# EAGLE design RadioESP32S3 (EAGLE 7.7.0)
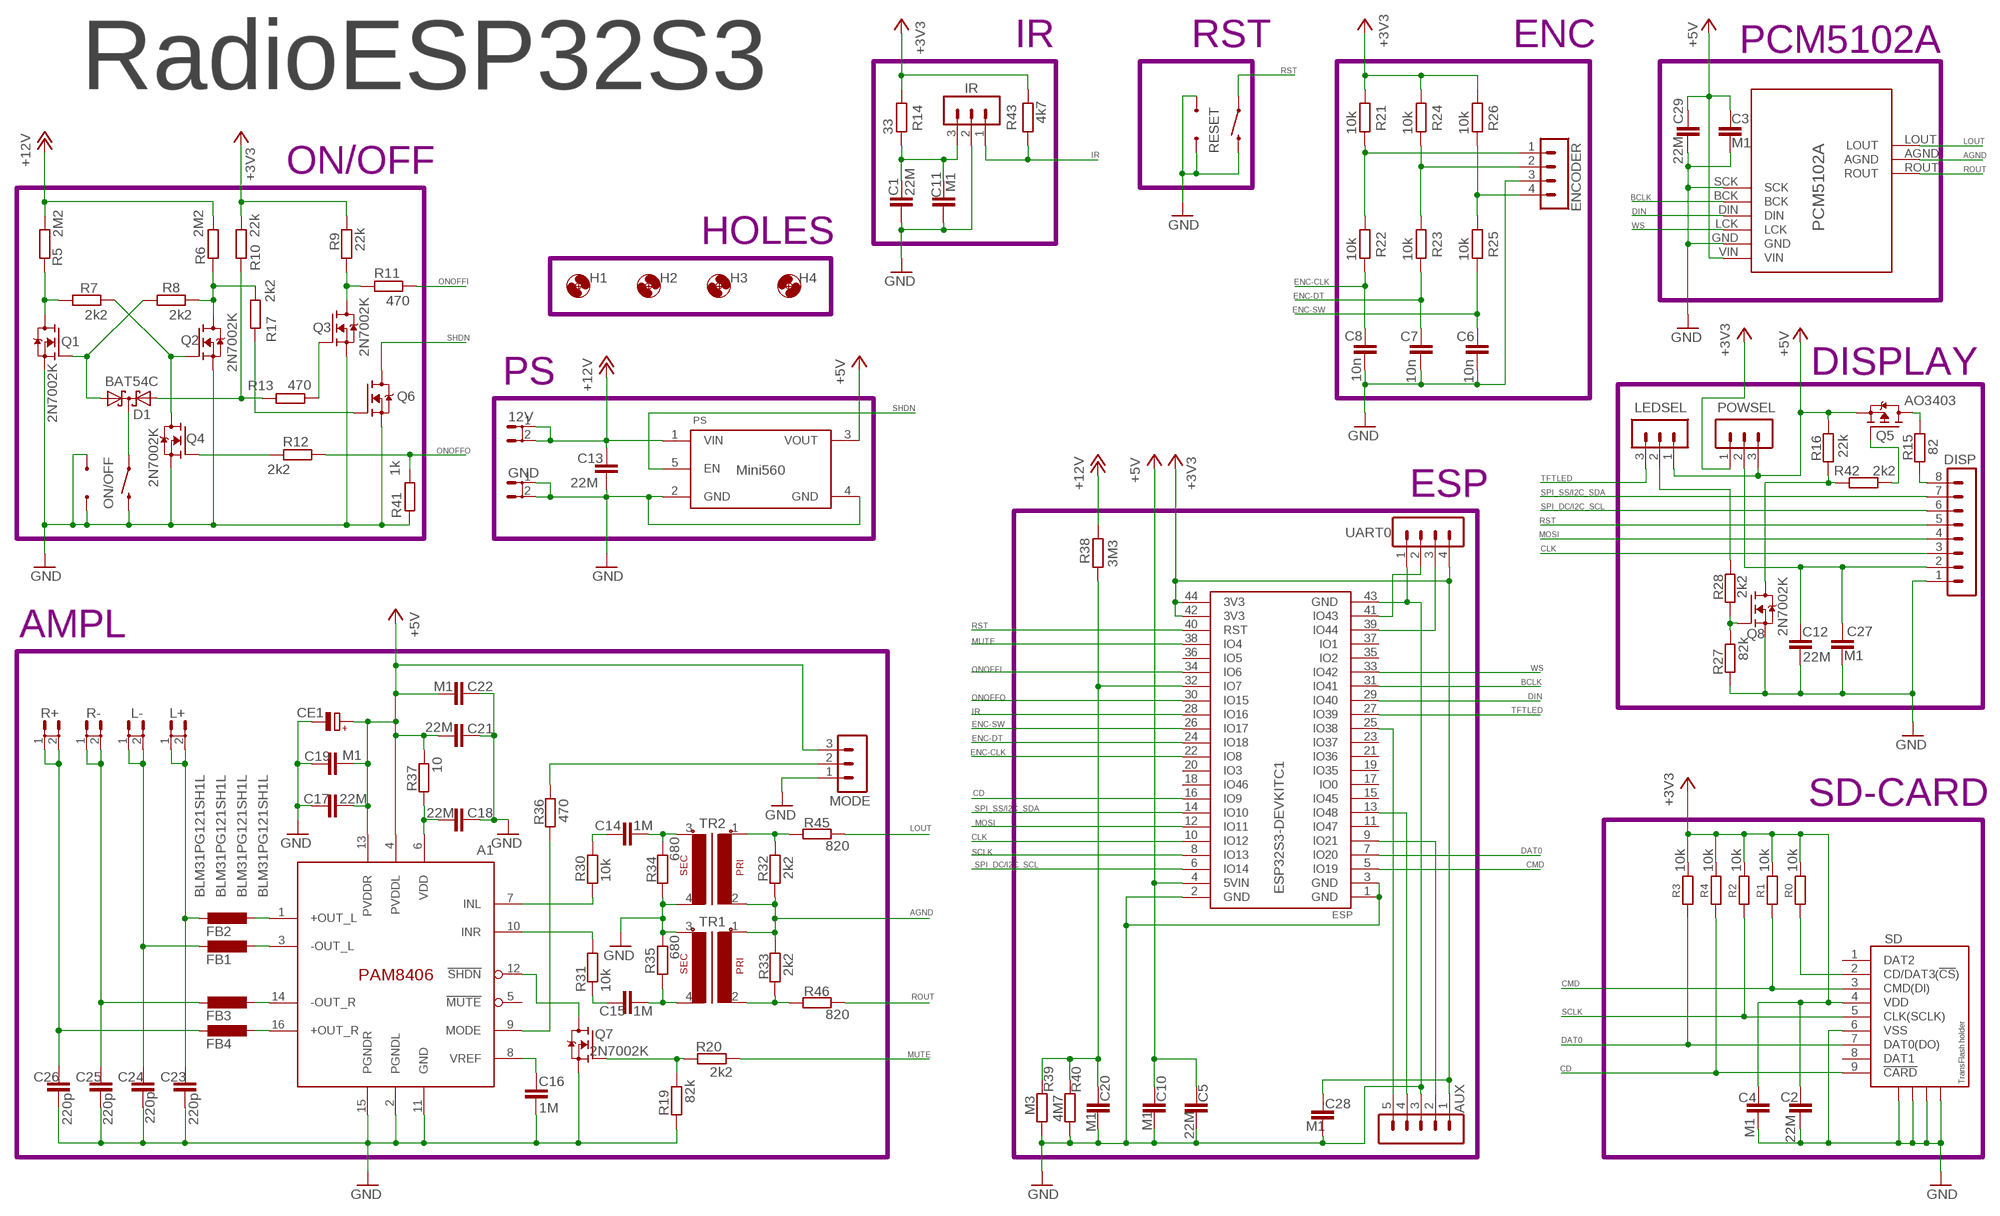
[diagram p0: schematic, sheet 1]

## Parts
12V  FASTON  [FASTON4.8]
A1  PAM8406  [SOP-16]
AUX  CON-LSTB_MA05-108  [CON-LSTB_MA05-1-NS08]
C1  22M  C-EUC1206K  [C1206K]
C2  22M  C-EUC1206K  [C1206K]
C3  M1  C-EUC0805  [C0805]
C4  M1  C-EUC0805  [C0805]
C5  22M  C-EUC1206K  [C1206K]
C6  10n  C-EUC0805  [C0805]
C7  10n  C-EUC0805  [C0805]
C8  10n  C-EUC0805  [C0805]
C10  M1  C-EUC0805  [C0805]
C11  M1  C-EUC0805  [C0805]
C12  22M  C-EUC1206K  [C1206K]
C13  22M  C-EUC1206K  [C1206K]
C14  1M  C-EUC1206K  [C1206K]
C15  1M  C-EUC1206K  [C1206K]
C16  1M  C-EUC1206K  [C1206K]
C17  22M  C-EUC1206K  [C1206K]
C18  22M  C-EUC1206K  [C1206K]
C19  M1  C-EUC0805  [C0805]
C20  M1  C-EUC0805  [C0805]
C21  22M  C-EUC1206K  [C1206K]
C22  M1  C-EUC0805  [C0805]
C23  220p  C-EUC0805  [C0805]
C24  220p  C-EUC0805  [C0805]
C25  220p  C-EUC0805  [C0805]
C26  220p  C-EUC0805  [C0805]
C27  M1  C-EUC0805  [C0805]
C28  M1  C-EUC0805  [C0805]
C29  22M  C-EUC1206K  [C1206K]
CE1  CPOL  [E5-10.5]
D1  BAT54C  [SOT23]
DISP  CON-LSTB_MA08-108  [CON-LSTB-MA08-1-NS08]
ENCODER  CON-LSTB_MA04-108  [CON-LSTB_MA04-1-NS08]
ESP  ESP32S3-DEVKITC1  [ESP32S3-DEVKITC1]
FB1  BLM31PG121SH1L  BEAD_0805-K  [C1206K]
FB2  BLM31PG121SH1L  BEAD_0805-K  [C1206K]
FB3  BLM31PG121SH1L  BEAD_0805-K  [C1206K]
FB4  BLM31PG121SH1L  BEAD_0805-K  [C1206K]
GND  FASTON  [FASTON4.8]
H1  MOUNT-HOLE3.0  [3,0]
H2  MOUNT-HOLE3.0  [3,0]
H3  MOUNT-HOLE3.0  [3,0]
H4  MOUNT-HOLE3.0  [3,0]
IR  CON-LSTB_MA03-108  [CON-LSTB_MA03-1-NS08]
L+  FASTON  [FASTON4.8]
L-  FASTON  [FASTON4.8]
LEDSEL  CON-LSTB_MA03-108  [CON-LSTB_MA03-1-NS08]
MODE  CON-LSTB_MA03-108  [CON-LSTB_MA03-1-NS08]
ON/OFF  MOMENTARY-SWITCH-SPST1  [TACTILE_SWITCH_ANGLE-NS1]
PCM5102A  PCM5102A_MODULE  [PCM5102A_MODULE]
POWSEL  CON-LSTB_MA03-108  [CON-LSTB_MA03-1-NS08]
PS  MINI560EXT  [MINI560-NS-EXT]
Q1  2N7002K  TRANSISTOR-FET_N-MOSFET  [TRANSISTOR-FET_SOT23]
Q2  2N7002K  TRANSISTOR-FET_N-MOSFET  [TRANSISTOR-FET_SOT23]
Q3  2N7002K  TRANSISTOR-FET_N-MOSFET  [TRANSISTOR-FET_SOT23]
Q4  2N7002K  TRANSISTOR-FET_N-MOSFET  [TRANSISTOR-FET_SOT23]
Q5  AO3403  P-MOSFET  [SOT23]
Q6  2N7002K  TRANSISTOR-FET_N-MOSFET  [TRANSISTOR-FET_SOT23]
Q7  2N7002K  TRANSISTOR-FET_N-MOSFET  [TRANSISTOR-FET_SOT23]
Q8  2N7002K  TRANSISTOR-FET_N-MOSFET  [TRANSISTOR-FET_SOT23]
R0  10k  R-EU_R0805  [R0805]
R1  10k  R-EU_R0805  [R0805]
R2  10k  R-EU_R0805  [R0805]
R3  10k  R-EU_R0805  [R0805]
R4  10k  R-EU_R0805  [R0805]
R5  2M2  R-EU_R0805  [R0805]
R6  2M2  R-EU_R0805  [R0805]
R7  2k2  R-EU_R0805  [R0805]
R8  2k2  R-EU_R0805  [R0805]
R9  22k  R-EU_R0805  [R0805]
R10  22k  R-EU_R0805  [R0805]
R11  470  R-EU_R0805  [R0805]
R12  2k2  R-EU_R0805  [R0805]
R13  470  R-EU_R0805  [R0805]
R14  33  R-EU_R0805  [R0805]
R15  82  R-EU_R1206  [R1206]
R16  22k  R-EU_R0805  [R0805]
R17  2k2  R-EU_R0805  [R0805]
R19  82k  R-EU_R0805  [R0805]
R20  2k2  R-EU_R0805  [R0805]
R21  10k  R-EU_R0805  [R0805]
R22  10k  R-EU_R0805  [R0805]
R23  10k  R-EU_R0805  [R0805]
R24  10k  R-EU_R0805  [R0805]
R25  10k  R-EU_R0805  [R0805]
R26  10k  R-EU_R0805  [R0805]
R27  82k  R-EU_R0805  [R0805]
R28  2k2  R-EU_R0805  [R0805]
R30  10k  R-EU_R0805  [R0805]
R31  10k  R-EU_R0805  [R0805]
R32  2k2  R-EU_R0805  [R0805]
R33  2k2  R-EU_R0805  [R0805]
R34  680  R-EU_R0805  [R0805]
R35  680  R-EU_R0805  [R0805]
R36  470  R-EU_R0805  [R0805]
R37  10  R-EU_R0805  [R0805]
R38  3M3  R-EU_R0805  [R0805]
R39  M3  R-EU_R0805  [R0805]
R40  4M7  R-EU_R0805  [R0805]
R41  1k  R-EU_R0805  [R0805]
R42  2k2  R-EU_R0805  [R0805]
R43  4k7  R-EU_R0805  [R0805]
R45  820  R-EU_R0805  [R0805]
R46  820  R-EU_R0805  [R0805]
R+  FASTON  [FASTON4.8]
R-  FASTON  [FASTON4.8]
RESET  MOMENTARY-SWITCH-SPST1  [TACTILE_SWITCH_ANGLE-NS1]
SD  SD-MMC_TF-HOLDER  [SD-MMC_TF-PULL]
TR1  AUDIOTRAFONS2  [AUDIOTRAFO_2-NS]
TR2  AUDIOTRAFONS2  [AUDIOTRAFO_2-NS]
UART0  CON-LSTB_MA04-108  [CON-LSTB_MA04-1-NS08]

## Nets
+3V3: AUX.1 C2.2 C4.2 C28.2 ESP.42(3V3) ESP.44(3V3) POWSEL.1 R0.2 R1.2 R2.2 R3.2 R4.2 R9.2 R10.2 R14.2 R21.2 R24.2 R26.2 R43.1 SD.4(VDD) UART0.4
+5V: A1.4(PVDDL) A1.13(PVDDR) C3.1 C5.1 C10.1 C17.2 C19.2 C21.1 C22.1 C29.2 CE1.+ CE1.++(+) ESP.4(5VIN) LEDSEL.1 MODE.3 PCM5102A.VIN POWSEL.3 PS.3(VOUT) Q5.2(S) R16.2 R37.1
+12V: 12V.1 12V.2 C13.2 PS.1(VIN) R5.2 R6.2 R38.2
AGND: PCM5102A.AGND R32.1 R33.2 TR1.1 TR2.2
BCLK: ESP.31(IO41) PCM5102A.BCK
CD: ESP.16(IO9) R4.1 SD.9(!CARD)
CLK: DISP.3 ESP.10(IO12)
CMD: ESP.5(IO19) R1.1 SD.3(CMD(DI))
DAT0: ESP.7(IO20) R3.1 SD.7(DAT0(DO))
DIN: ESP.29(IO40) PCM5102A.DIN
ENC-CLK: C8.1 ESP.22(IO8) R22.1
ENC-DT: C7.1 ESP.24(IO18) R23.1
ENC-SW: C6.1 ESP.26(IO17) R25.1
GND: A1.2(PGNDL) A1.11(GND) A1.15(PGNDR) AUX.3 C1.2 C2.1 C3.2 C4.1 C5.2 C6.2 C7.2 C8.2 C10.2 C11.2 C12.1 C13.1 C16.1 C17.1 C18.2 C19.1 C20.1 C21.2 C22.2 C23.1 C24.1 C25.1 C26.1 C27.2 C28.1 C29.1 CE1.- DISP.1 ENCODER.3 ESP.1(GND) ESP.2(GND) ESP.3(GND) ESP.43(GND) GND.1 GND.2 IR.2 MODE.1 ON/OFF.2 ON/OFF.A1 ON/OFF.A2 PCM5102A.GND PCM5102A.SCK PS.2(GND) PS.4(GND) Q1.2(S) Q2.2(S) Q3.2(S) Q4.2(S) Q6.2(S) Q7.2(S) Q8.2(S) R19.2 R27.2 R34.1 R35.2 R39.1 R40.1 R41.1 RESET.2 RESET.A1 RESET.A2 SD.6(VSS) SD.S1 SD.S2 SD.S3 SD.S4 TR1.3(S1) TR2.4(S2) UART0.1
IR: ESP.28(IO16) IR.1 R43.2
LEDA: DISP.8 R15.1
LOUT: PCM5102A.LOUT R45.2
MOSI: DISP.4 ESP.12(IO11)
MUTE: ESP.38(IO4) R20.1
N31: D1.2(A2) R10.1 R13.2
N$1: ESP.39(IO44) UART0.3
N$2: ESP.41(IO43) UART0.2
N$3: C14.1 R34.2 TR2.3(S1)
N$4: C15.2 R35.1 TR1.4(S2)
N$5: C14.2 R30.2
N$6: A1.7(INL) R30.1
N$7: C15.1 R31.2
N$8: A1.10(INR) R31.1
N$9: C1.1 C11.1 IR.3 R14.1
N$10: Q2.3(D) R6.1 R8.1 R17.1
N$11: Q7.1(G) R19.1 R20.2
N$12: R0.1 SD.2(CD/DAT3(!CS!))
N$14: Q3.1(G) R13.1
N$16: Q1.3(D) R5.1 R7.2
N$17: Q5.1(G) R42.1
N$18: D1.3(CC) ON/OFF.1
N$19: Q2.1(G) Q4.3(D) R7.1
N$20: D1.1(A1) Q1.1(G) R8.2
N$21: Q4.1(G) R12.2
N$22: AUX.4 ESP.13(IO48)
N$23: Q3.3(D) R9.1 R11.2
N$25: AUX.2 ESP.9(IO21)
N$26: C12.2 C27.1 DISP.2 POWSEL.2
N$27: R32.2 R45.1 TR2.1
N$28: A1.8(VREF) C16.2
N$29: A1.12(!SHDN) Q7.3(D)
N$30: A1.9(MODE) R36.1
N$31: MODE.2 R36.2
N$32: C23.2 FB2.2 L+.1 L+.2
N$33: R33.1 R46.1 TR1.2
N$34: C25.2 FB3.2 R-.1 R-.2
N$35: C26.2 FB4.2 R+.1 R+.2
N$36: A1.1(+OUT_L) FB2.1
N$38: A1.3(-OUT_L) FB1.1
N$39: A1.14(-OUT_R) FB3.1
N$41: A1.16(+OUT_R) FB4.1
N$42: Q5.3(D) R15.2
N$44: Q8.3(D) R16.1 R42.2
N$47: C20.2 ESP.32(IO7) R38.1 R39.2 R40.2
N$49: Q6.1(G) R17.2
N$50: C24.2 FB1.2 L-.1 L-.2
N$51: ENCODER.4 R25.2 R26.1
N$52: ENCODER.2 R23.2 R24.1
N$53: ENCODER.1 R21.1 R22.2
N$54: Q8.1(G) R27.1 R28.1
ONOFFI: ESP.34(IO6) R11.1
ONOFFO: ESP.30(IO15) R12.1 R41.2
ROUT: PCM5102A.ROUT R46.2
RST: DISP.5 ESP.40(RST) RESET.1
SCLK: ESP.8(IO13) R2.1 SD.5(CLK(SCLK))
SHDN: PS.5(EN) Q6.3(D)
SPI_DC/I2C_SCL: DISP.6 ESP.6(IO14)
SPI_SS/I2C_SDA: DISP.7 ESP.14(IO10)
TFTG: LEDSEL.2 R28.2
TFTLED: ESP.27(IO39) LEDSEL.3
VDD: A1.6(VDD) C18.1 R37.2
WS: ESP.33(IO42) PCM5102A.LCK
XDCS: AUX.5 ESP.25(IO38)
Unconnected: A1.5(!MUTE) ESP.11(IO47) ESP.15(IO45) ESP.17(IO0) ESP.18(IO46) ESP.19(IO35) ESP.20(IO3) ESP.21(IO36) ESP.23(IO37) ESP.35(IO2) ESP.36(IO5) ESP.37(IO1) SD.1(DAT2) SD.8(DAT1)

## Notes on the sheet
- IR | RST | ENC | PCM5102A
- RadioESP32S3
- ON/OFF
- HOLES
- PS | DISPLAY
- ESP
- AMPL
- SD-CARD

## Library data of the parts
12V GND L+ L- R+ R- = mainboard-v4aW-jlcpcb:FASTON
A1 = mainboard-v4aW-jlcpcb:PAM8406
AUX = mainboard-v4aW-jlcpcb:CON-LSTB_MA05-1: PIN HEADER
C1-C5 C10-C29 = mainboard-v4aW-jlcpcb:C-EU: CAPACITOR, European symbol
C6-C8 = rcl:C-EU: CAPACITOR, European symbol
CE1 = mainboard-v4aW-jlcpcb:CPOL
D1 = mainboard-v4aW-jlcpcb:BAT54C: Schottky Diodes Source: Fairchild .. BAT54.pdf
DISP = mainboard-v4aW-jlcpcb:CON-LSTB_MA08-1
ENCODER UART0 = mainboard-v4aW-jlcpcb:CON-LSTB_MA04-1
ESP = mainboard-v4aW-jlcpcb:ESP32S3-DEVKITC1
FB1-FB4 = mainboard-v4aW-jlcpcb:BEAD_0805
H1-H4 = mainboard-v4aW-jlcpcb:MOUNT-HOLE: MOUNTING HOLE with drill center marker
IR LEDSEL MODE POWSEL = mainboard-v4aW-jlcpcb:CON-LSTB_MA03-1
ON/OFF RESET = mainboard-v4aW-jlcpcb:MOMENTARY-SWITCH-SPST: Momentary Switch (Pushbutton) - SPST Normally-open (NO) SPST momentary switches (buttons, pushbuttons). Variants PTH-12MM - 12mm square, through-hole Momentary Pushbutton Switch - 12mm Square <https://www.sparkfun.com/products/9190> (COM-09190) PTH-6.0MM, PTH-6.0MM-KIT - 6.0mm square, through-hole Mini Pushbutton Switch <https://www.sparkfun.com/products/97> (COM-00097) KIT package intended for soldering kit's - only one side of pads' copper is exposed. PTH-RIGHT-ANGLE-KIT - Right-angle, through-hole Right Angle Tactile Button <https://www.sparkfun.com/products/10791> - Used on SparkFun BigTime Watch Kit <https://www.sparkfun.com/products/11734> SMD-12MM - 12mm square, surface-mount Tactile Button - SMD (12mm) <https://www.sparkfun.com/products/12993> (COM-12993) Used on SparkFun PicoBoard <https://www.sparkfun.com/products/11888> SMD-4.5MM - 4.5mm Square Trackball Switch Used on SparkFun Blackberry Trackballer Breakout <https://www.sparkfun.com/products/13169> SMD-4.6MMX2.8MM - 4.60mm x 2.80mm, surface mount Used on SparkFun Pro Micro - RP2040 <https://www.sparkfun.com/products/17717> SMD-5.2MM, SMD-5.2-REDUNDANT - 5.2mm square, surface-mount Mini Pushbutton Switch - SMD <https://www.sparkfun.com/products/8720> (COM-08720) Used on Arduino Pro Mini <https://www.sparkfun.com/products/11114> REDUNDANT package connects both switch circuits together SMD-6.0X3.5MM - 6.0 x 3.5mm, surface mount Momentary Reset Switch SMD <https://www.sparkfun.com/products/8229> (COM-08229) SMD-6.2MM-TALL - 6.2mm square, surface mount Tactile Button - SMD (6mm) <https://www.sparkfun.com/products/12992> Used on SparkFun Digital Sandbox <https://www.sparkfun.com/products/12651> SMD-RIGHT-ANGLE - Right-angle, surface mount Used on SparkFun Block for Intel® Edison - Arduino <https://www.sparkfun.com/products/13036>
PCM5102A = mainboard-v4aW-jlcpcb:PCM5102A_MODULE
PS = mainboard-v4aW-jlcpcb:MINI560
Q1-Q4 Q6-Q8 = mainboard-v4aW-jlcpcb:TRANSISTOR-FET_N-MOSFET
Q5 = transistor-fet:P-MOSFET
R0 R1-R17 R19-R28 R30-R43 R45 R46 = mainboard-v4aW-jlcpcb:R-EU_: RESISTOR, European symbol
SD = mainboard-v4aW-jlcpcb:SD-MMC_TF-HOLDER: TF / Micro SD socket is PUSH-PUSH type, the card can be pushed into and auto locked and pushed out by simply press the card. Surface Mounting type.
TR1 TR2 = mainboard-v4aW-jlcpcb:AUDIOTRAFO

## Module AMP
Ports: 

### Library data of the parts

## Board
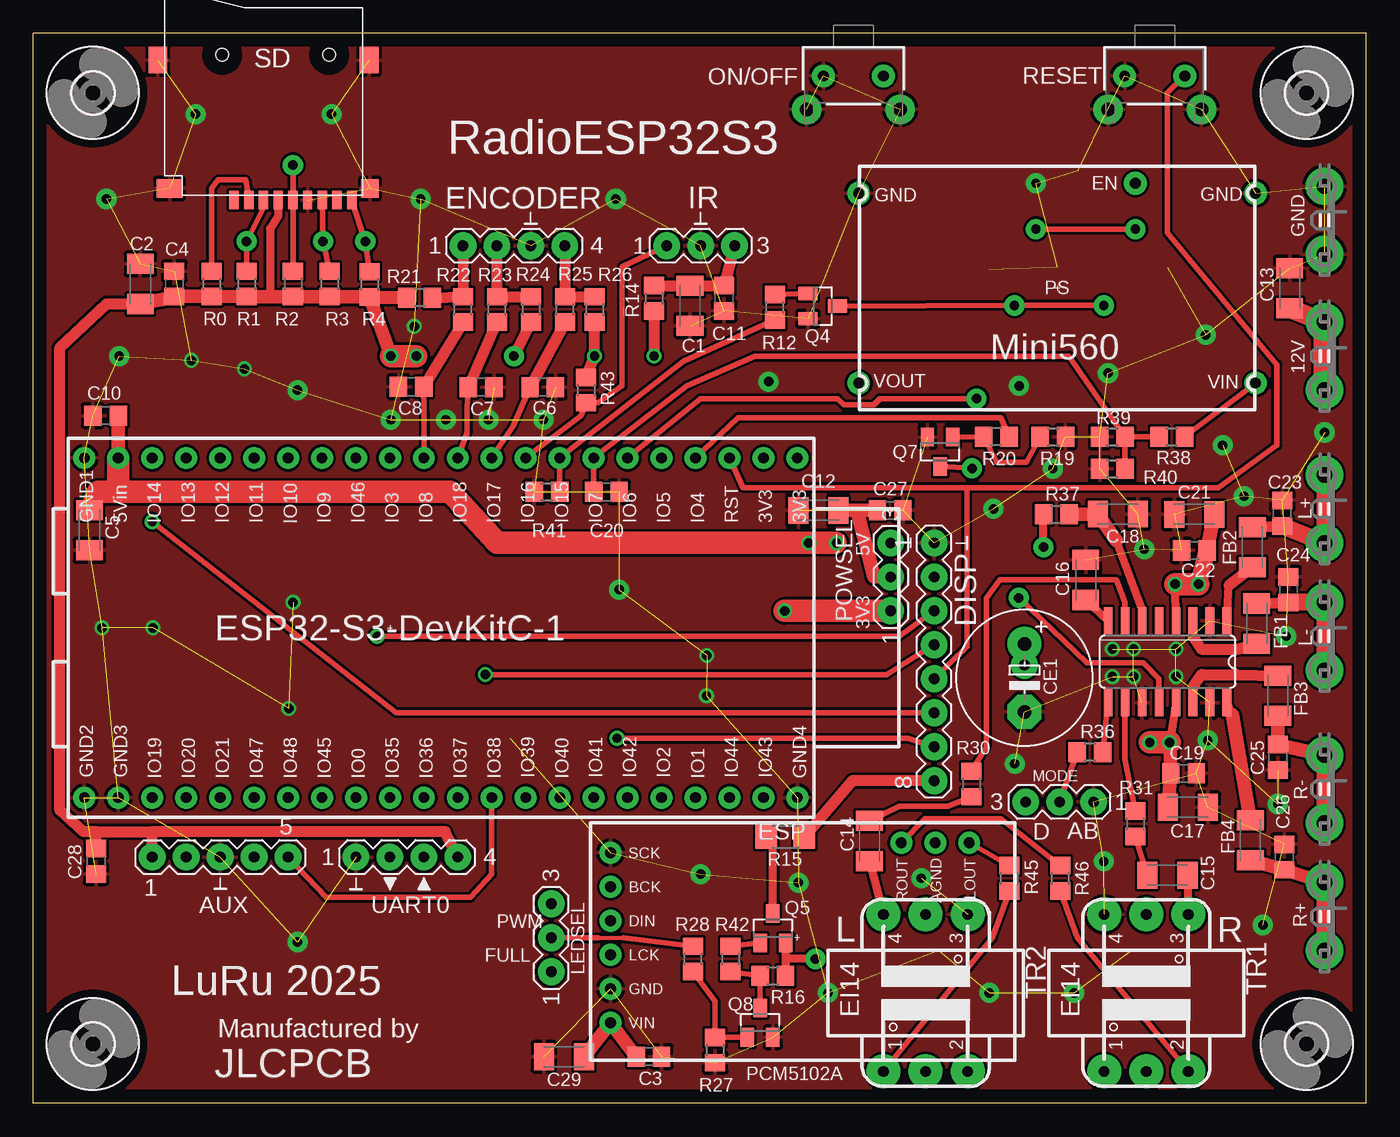
[diagram p1: board, top side]
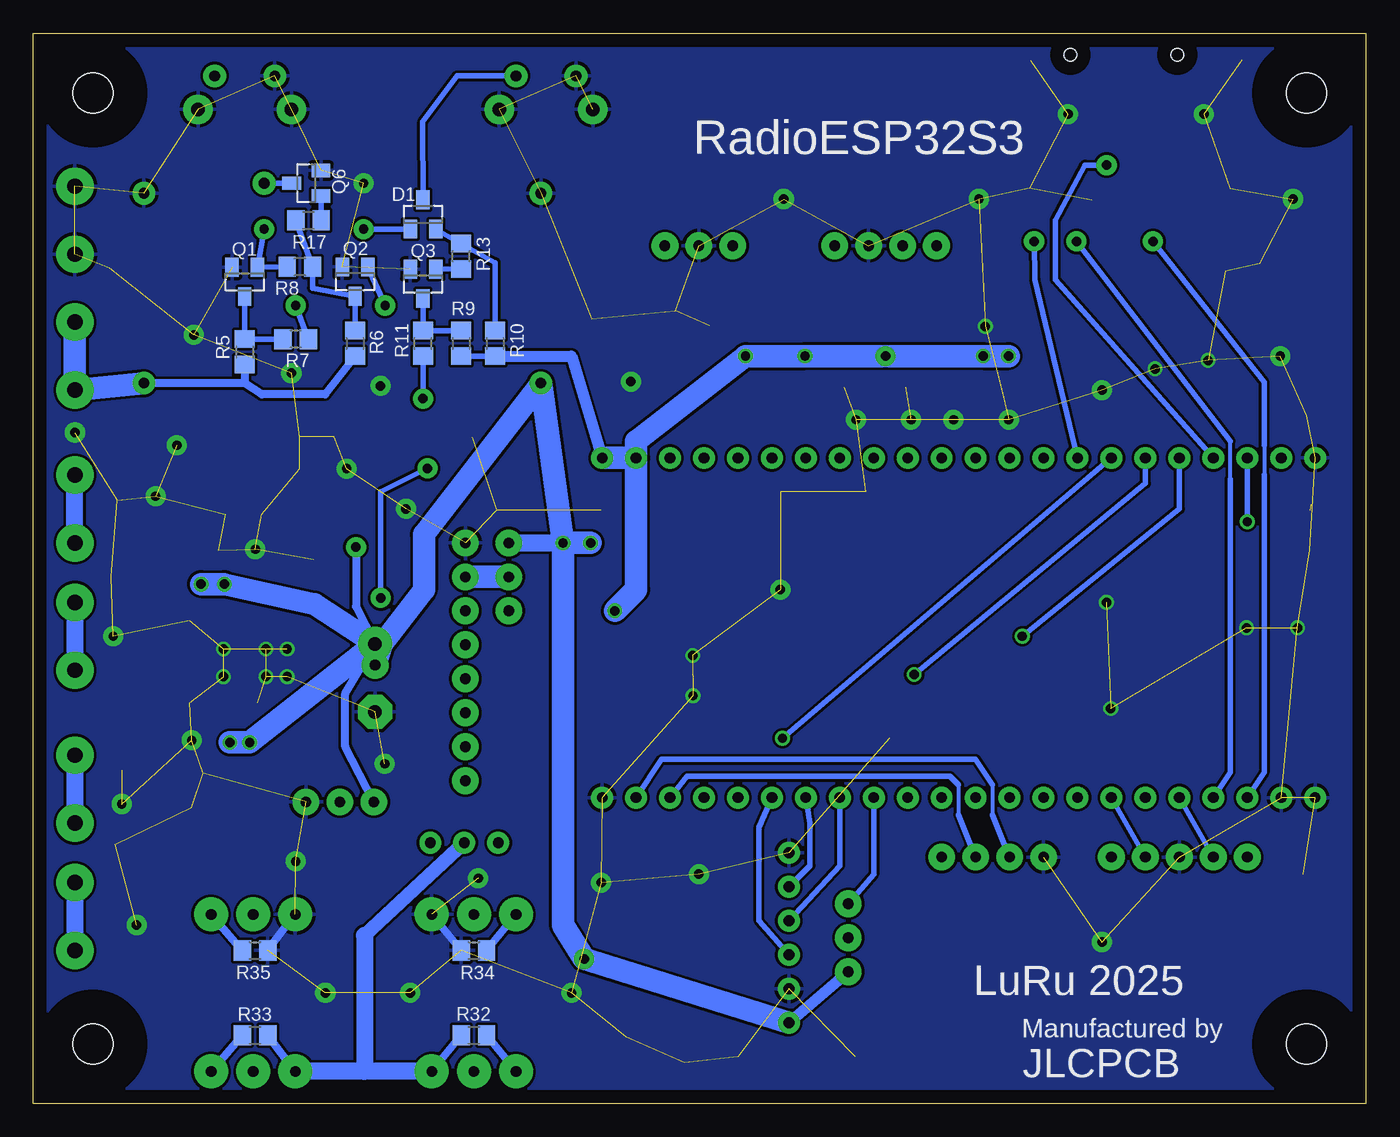
[diagram p2: board, bottom side, seen from below]

Size 99.69 x 80 mm. Coordinates in mm from the lower left corner, seen from the top.
Outline: 99.69,80 0,80 0,0 99.69,0 99.69,80
Copper layers (1*16): Top 0.035mm / dielectric 1.5mm / Bottom 0.035mm
Design rules "default *": minimum track width 10mil, minimum drill 24mil, track to track 8mil, track to pad 8mil, pad to pad 8mil, via to via 8mil, smd to smd 8mil, copper to edge 40mil, drill to drill 8mil, minimum pad ring 10mil, minimum via ring 8mil, stop-mask expansion 4mil, vias tented up to drill 30mil, thermal gap 10mil

### Footprints (pad centres in the part's own frame; a part is rotated, then mirrored left to right if it is on the bottom)
FASTON4.8 = drill 1.15 pad 2.794: 1 -2.54,0; 2 2.54,0
SOP-16 = smd 0.66 x 2.032: 1 -4.445,-3.073; 2 -3.175,-3.073; 3 -1.905,-3.073; 4 -0.635,-3.073; 5 0.635,-3.073; 6 1.905,-3.073; 7 3.175,-3.073; 8 4.445,-3.073; 9 4.445,3.073; 10 3.175,3.073; 11 1.905,3.073; 12 0.635,3.073; 13 -0.635,3.073; 14 -1.905,3.073; 15 -3.175,3.073; 16 -4.445,3.073
CON-LSTB_MA05-1-NS08 = drill 0.8 pad 2: 1 -5.08,0; 2 -2.54,0; 3 0,0; 4 2.54,0; 5 5.08,0
C1206K = smd 1.5 x 2: 1 -1.5,0; 2 1.5,0
C0805 = smd 1.3 x 1.5: 1 -0.95,0; 2 0.95,0
E5-10.5 = drill 1.016 pad 2.54: + -2.54,0 | drill 0.8 pad 2: ++ -0.953,0 | drill 1.016 pad 2.54 octagon: - 2.54,0
SOT23 = smd 1 x 1.4: 1 -0.95,-1.1; 2 0.95,-1.1; 3 0,1.1
CON-LSTB-MA08-1-NS08 = drill 0.8 pad 2: 1 -8.89,0; 2 -6.35,0; 3 -3.81,0; 4 -1.27,0; 5 1.27,0; 6 3.81,0; 7 6.35,0; 8 8.89,0
CON-LSTB_MA04-1-NS08 = drill 0.8 pad 2: 1 -3.81,0; 2 -1.27,0; 3 1.27,0; 4 3.81,0
ESP32S3-DEVKITC1 = drill 0.8 pad 1.64: 1 30.48,12.7; 2 30.48,-12.7; 3 27.94,12.7; 4 27.94,-12.7; 5 25.4,12.7; 6 25.4,-12.7; 7 22.86,12.7; 8 22.86,-12.7; 9 20.32,12.7; 10 20.32,-12.7; 11 17.78,12.7; 12 17.78,-12.7; 13 15.24,12.7; 14 15.24,-12.7; 15 12.7,12.7; 16 12.7,-12.7; 17 10.16,12.7; 18 10.16,-12.7; 19 7.62,12.7; 20 7.62,-12.7; 21 5.08,12.7; 22 5.08,-12.7; 23 2.54,12.7; 24 2.54,-12.7; 25 0,12.7; 26 0,-12.7; 27 -2.54,12.7; 28 -2.54,-12.7; 29 -5.08,12.7; 30 -5.08,-12.7; 31 -7.62,12.7; 32 -7.62,-12.7; 33 -10.16,12.7; 34 -10.16,-12.7; 35 -12.7,12.7; 36 -12.7,-12.7; 37 -15.24,12.7; 38 -15.24,-12.7; 39 -17.78,12.7; 40 -17.78,-12.7; 41 -20.32,12.7; 42 -20.32,-12.7; 43 -22.86,12.7; 44 -22.86,-12.7
3,0 = hole 3: 0,0
CON-LSTB_MA03-1-NS08 = drill 0.8 pad 2: 1 -2.54,0; 2 0,0; 3 2.54,0
TACTILE_SWITCH_ANGLE-NS1 = drill 0.8 pad 1.7: 1 -2.25,0; 2 2.25,0 | drill 1 pad 2.2: A1 -3.5,2.5; A2 3.5,2.5
PCM5102A_MODULE = drill 0.8 pad 1.64: AGND -10.312,-7.102; BCK 13.97,-3.81; DIN 13.97,-1.27; GND 13.97,3.81; LCK 13.97,1.27; LOUT -12.852,-7.102; ROUT -7.772,-7.102; SCK 13.97,-6.35; VIN 13.97,6.35
MINI560-NS-EXT = drill 0.8 pad 1.7: 1 -14.85,7.1; 2 -14.85,-7.1; 3 14.85,7.1; 4 14.85,-7.1; 5 -5.85,-7.85
TRANSISTOR-FET_SOT23 = smd 1 x 1.4: 1 -0.95,-1.1; 2 0.95,-1.1; 3 0,1.1
R0805 = smd 1.3 x 1.5: 1 -0.95,0; 2 0.95,0
R1206 = smd 1.6 x 1.803: 1 -1.422,0; 2 1.422,0
SD-MMC_TF-PULL = smd 0.7 x 1.4: 1 -2.2,-7.62; 2 -1.1,-7.62; 3 0,-7.62; 4 1.1,-7.62; 5 2.2,-7.62; 6 3.3,-7.62; 7 4.4,-7.62; 8 5.5,-7.62; 9 6.6,-7.62 | smd 1.4 x 2: S1 -7.9,2.85; S2 7.9,2.85 | smd 1.28 x 1.4: S3 7.96,-6.75 | smd 1.95 x 1.4: S4 -7.025,-6.75 | hole 0.95: -3.1,3.25; 4.9,3.25
AUDIOTRAFO_2-NS = drill 0.8 pad 2.54: 1 -5.87,3.15; 2 -5.87,-3.15; 3 5.87,3.15; 4 5.87,-3.15; 5 -5.87,0; 6 5.87,0

### Placement (x,y rotation side)
12V  96.59,55.87 90 top
A1  84.84,33.01 180 top
AUX  13.97,18.4 0 top
C1  49.12,59.64 270 top
C2  8.01,61.27 270 top
C3  46.04,3.48 0 top
C4  10.54,61.27 270 top
C5  4.2,42.85 270 top
C6  38.1,53.55 0 top
C7  33.5,53.55 0 top
C8  28.26,53.58 180 top
C10  5.4,51.42 180 top
C11  51.66,60.19 270 top
C12  58.73,44.33 0 top
C13  93.97,60.95 270 top
C14  62.55,19.61 90 top
C15  84.84,17.04 0 top
C16  78.72,39.13 270 top
C17  86.36,22.12 180 top
C18  81.12,44.05 0 top
C19  86.04,24.66 180 top
C20  42.86,45.71 180 top
C21  86.84,44.03 180 top
C22  86.84,41.33 180 top
C23  93.41,44.12 270 top
C24  93.89,38.4 270 top
C25  93.09,25.86 90 top
C26  93.57,18.4 270 top
C27  64.09,44.33 0 top
C28  4.7,18.09 90 top
C29  39.69,3.48 0 top
CE1  74.14,31.8 270 top
D1  70.55,66.46 0 bottom
DISP  67.38,33.01 270 top
ENCODER  35.95,64.12 0 top
ESP  34.29,35.55 180 top
FB1  91.51,35.86 90 top
FB2  91.19,41.58 90 top
FB3  93.09,30.47 270 top
FB4  91.03,19.67 270 top
GND  96.59,66.03 90 top
H1  4.45,75.55 180 top
H2  4.45,4.43 180 top
H3  95.25,75.55 180 top
H4  95.25,4.43 180 top
IR  49.91,64.12 0 top
L+  96.59,44.44 90 top
L-  96.59,34.91 90 top
LEDSEL  38.73,12.37 90 top
MODE  76.77,22.53 180 top
ON/OFF  61.34,76.82 180 top
PCM5102A  57.15,12.37 180 top
POWSEL  64.14,39.36 90 top
PS  76.58,60.95 180 top
Q1  83.89,61.42 180 bottom
Q2  75.63,61.44 180 bottom
Q3  70.55,61.27 180 bottom
Q4  59.04,59.61 270 top
Q5  55.32,13.08 0 top
Q6  79.28,68.8 90 bottom
Q7  67.83,48.71 180 top
Q8  54.36,6.02 0 top
R0  13.34,61.27 270 top
R1  15.94,61.27 270 top
R2  19.41,61.27 270 top
R3  22.16,61.27 270 top
R4  25.14,61.23 270 top
R5  83.89,56.18 270 bottom
R6  75.63,56.82 270 bottom
R7  80.08,57.14 180 bottom
R8  79.76,62.53 180 bottom
R9  67.69,56.82 270 bottom
R10  65.16,56.82 270 bottom
R11  70.55,56.82 90 bottom
R12  55.47,59.52 90 top
R13  67.69,63.34 90 bottom
R14  46.42,60.19 270 top
R15  56.25,19.92 180 top
R16  55.31,9.51 0 top
R17  79.12,66.02 0 bottom
R19  76.27,49.82 0 top
R20  72.03,49.85 180 top
R21  28.89,60.24 180 top
R22  32.13,59.36 90 top
R23  34.67,59.36 90 top
R24  37.22,59.36 270 top
R25  39.76,59.36 90 top
R26  41.98,59.36 270 top
R27  50.99,3.98 270 top
R28  49.34,10.78 90 top
R30  70.17,23.87 270 top
R31  82.42,20.89 270 top
R32  66.74,5.07 0 bottom
R33  83.12,5.07 0 bottom
R34  66.74,11.42 0 bottom
R35  83.12,11.42 0 bottom
R36  79.04,26.23 180 top
R37  76.52,44.03 0 top
R38  85.16,49.83 0 top
R39  80.71,49.83 0 top
R40  80.71,47.45 0 top
R41  38.42,45.71 0 top
R42  52.14,10.78 270 top
R43  41.34,53.33 270 top
R45  73.03,16.82 90 top
R46  76.83,16.82 90 top
R+  96.59,13.96 90 top
R-  96.59,23.48 90 top
RESET  83.89,76.82 180 top
SD  17.21,75.15 0 top
TR1  83.25,8.24 90 top
TR2  66.74,8.24 90 top
UART0  27.94,18.4 0 top

### Tracks (layer width: path | path; a pad name or v marks a point on that pad's centre or on a via)
+3V3  (via drill 0.7, 0.7 pad 1.5)
  Top 0.305: R3.2 22.86,60.32
  Top 0.406: 17.7,60.46 18.16,60.31 16.58,60.31 R1.2 | 10.84,60.34 C4.2 | 25.42,60.32 R4.2 | R0.2
  Top 0.61: SD.4 18.31,66.38 17.7,65.39 17.7,60.46
  Top 0.813: v35.95,55.87 R24.2 | 4.7,20.31 3.74,20.31 1.97,21.89 1.97,56.5 5.46,59.77 C2.2 | C28.2 4.7,20.31 | R26.2 v41.98,55.87 R43.1 | R14.2 v46.42,55.87 | 4.7,20.31 8.89,20.31 | AUX.1 8.89,20.31 | UART0.4 30.8,20.31 8.89,20.31
  Top 1.016: C2.2 10.84,60.34 R0.2 R1.2 R2.2 22.86,60.32 25.42,60.32 | v26.75,55.87 R4.2 R21.2
  Top 1.676: v28.64,55.87 v26.75,55.87 | POWSEL.1 v56.2,36.82
  Bottom 0.406: R10.2 R9.2
  Bottom 0.813: R10.2 59.44,55.87 ESP.44
  Bottom 1.676: 26.74,55.87 v28.64,55.87 v35.95,55.87 v41.98,55.87 v46.42,55.87 54.61,49.52 ESP.42 | v56.2,36.82 54.61,38.4 ESP.42 | ESP.44 ESP.42
+5V  (via drill 0.7, 0.7 pad 1.5)  (1 unrouted)
  Top 0.406: C3.1
  Top 0.61: Q5.2 56.27,10.78 | 56.27,10.78 R16.2 | v58.49,10.78 56.27,10.78 | v75.57,41.58 R37.1 | A1.13 v85,26.98 | A1.4 v85.41,38.81
  Top 1.016: C21.1 C22.1 | C3.1 PCM5102A.VIN C29.2 | C10.1 ESP.4 | v85,26.98 C19.2 C17.2 | 4.83,45.71 4.45,45.71 4.13,44.75
  Top 1.27: C22.1 v87.15,38.81
  Top 1.676: 4.83,45.71 6.35,45.71 | 6.35,45.71 31.18,45.71 34.67,41.9 v58.01,41.9 60.01,41.9 | v87.15,38.81 v85.41,38.81 | v85,26.98 v83.52,26.98 | ESP.4 6.35,45.71
  Bottom 0.406: CE1.+ CE1.++
  Bottom 0.61: v75.57,41.58 75.57,37.14 CE1.+ 76.36,30.63 76.36,26.66 MODE.3
  Bottom 0.813: LEDSEL.1 PCM5102A.VIN
  Bottom 1.27: POWSEL.3 v60.08,41.9
  Bottom 1.676: CE1.++ 73.66,34.28 70.48,38.4 70.48,42.53 PS.3 v60.08,41.9 | v60.08,41.9 v58.01,41.9 | v60.08,41.9 60.08,13.32 v58.49,10.78 PCM5102A.VIN | v85,26.98 v83.52,26.98 CE1.+ 78.65,37.29 v85.41,38.81 v87.15,38.81
+12V
  Top 0.406: R38.2 PS.1
  Top 1.422: C13.2 12V.2
  Top 1.676: 12V.2 12V.1
  Bottom 0.61: R5.2 83.89,53.85 | R6.2 77.86,53.01 82.62,53.01 83.89,53.85 | 83.89,53.85 PS.1
  Bottom 1.676: 12V.2 12V.1 PS.1
AGND
  Bottom 0.61: R32.1 TR2.2 | R33.2 TR1.1
  Bottom 0.813: 82.3,5.07 R33.2
  Bottom 1.016: 74.93,12.55 PCM5102A.AGND
  Bottom 1.27: TR2.2 74.93,2.37 | 74.93,2.37 TR1.1 | 74.93,12.55 74.93,2.37
BCLK
  Bottom 0.406: PCM5102A.BCK 41.59,17.77 41.59,20.94 ESP.31
CD  (via drill 0.7 pad 1.5)
  Top 0.406: SD.9 v24.83,64.44 R4.1
  Bottom 0.406: ESP.16 24.77,61.58 v24.83,64.44
CLK  (via drill 0.7)
  Top 0.406: v25.72,34.91 64.77,34.91 DISP.3
  Bottom 0.406: v25.72,34.91 13.97,44.44 ESP.10
CMD  (via drill 0.7 pad 1.5)
  Top 0.254: R1.1 16.58,62.53
  Top 0.406: R1.1 v15.94,64.44 17.21,66.98 SD.3
  Bottom 0.305: 7.62,49.2 7.62,46.98
  Bottom 0.406: 7.62,49.2 7.62,53.89 v15.94,64.44 | 7.62,46.98 7.62,24.75 ESP.5
DAT0  (via drill 0.7 pad 1.5)
  Top 0.406: SD.7 v21.66,64.44 R3.1
  Bottom 0.305: 10.16,46.66 10.16,49.52
  Bottom 0.406: ESP.7 10.16,24.75 10.16,46.66 | 10.16,49.52 v21.66,64.44
DIN
  Bottom 0.406: PCM5102A.DIN 39.37,17.77 ESP.29
ENC-CLK
  Top 0.406: C8.1 29.21,51.74 ESP.22
  Top 0.813: C8.1 R22.1
ENC-DT
  Top 0.406: C7.1 32.45,52.06 32.45,50.15 ESP.24
  Top 0.813: C7.1 R23.1
ENC-SW
  Top 0.406: ESP.26 35.88,50.63 C6.1
  Top 0.813: R25.1 C6.1
GND  (via drill 0.7, 0.7 pad 1.5)  (121 unrouted)
  Bottom 0.305: Q1.2 85.16,62.68
  Bottom 0.61: R34.1 TR2.4 | TR1.3 R35.2
  other vias: 75,68.8 85.47,31.9 85.47,33.96 82.3,31.9 80.71,31.9 80.71,33.96 82.3,33.96 71.5,8.24 12.13,73.97 22.29,73.97 43.81,38.4 15.78,54.91 80.08,18.09 87.7,57.45 19.75,53.33 26.74,51.1 34.04,51.1 30.86,51.1 38.17,51.1 66.42,16.82 73.41,25.39 88.97,49.2 76.27,47.45 96.59,50.15 91.98,13.32 77.86,8.24 83.09,41.42 93.73,34.91 93.09,22.37 49.91,17.13 19.75,12.05 80.39,54.6 90.56,45.39 43.56,67.61 28.96,67.61 5.46,67.61 6.42,55.87 57.22,16.5 11.81,55.55 5.13,35.55 71.82,44.44 19.42,37.45 19.1,29.52 87.86,27.13 50.35,30.47 50.38,33.48 28.48,58.09 59.44,8.24 8.94,35.55 54.99,53.96 73.73,53.64
  pour Top: 99.38,0.3 0.32,0.3 0.32,79.68 99.38,79.68
  pour Bottom: 0.32,79.68 99.38,79.68 99.38,0.3 0.32,0.3 0.32,0.62
IR
  Top 0.406: IR.1 44.04,62.53 44.04,53.64 42.23,52.38 R43.2 40.96,51.42 ESP.28
LEDA
  Top 0.813: DISP.8 61.28,24.12 R15.1
LOUT
  Top 0.406: PCM5102A.LOUT R45.2
MOSI  (via drill 0.7)
  Top 0.406: DISP.4 63.82,32.06 v33.81,32.06
  Bottom 0.406: v33.81,32.06 16.51,46.34 ESP.12
MUTE
  Top 0.406: R20.1 72.39,51.26 52.7,51.26 ESP.38
N31
  Bottom 0.406: D1.2 R13.2 65.16,62.85 R10.1
N$1
  Bottom 0.305: 30.48,23.8 30.48,21.58
  Bottom 0.406: ESP.39 50.8,24.44 31.11,24.44 30.48,23.8 | 30.48,21.58 UART0.3
N$2
  Bottom 0.305: 27.94,23.8 27.94,21.58
  Bottom 0.406: ESP.41 52.7,25.71 29.21,25.71 27.94,23.8 | 27.94,21.58 UART0.2
N$3
  Top 0.61: C14.1 TR2.3
  Bottom 0.61: R34.2 TR2.3
N$4
  Top 0.61: C15.2 TR1.4
  Bottom 0.61: R35.1 TR1.4
N$5
  Top 0.406: C14.2 64.77,22.21 68.42,22.21 R30.2
N$6
  Top 0.406: A1.7 81.67,37.45 81.03,39.13 72.3,39.13 71.28,37.77 71.28,26.66 R30.1
N$7
  Top 0.406: R31.2 C15.1
N$8
  Top 0.406: A1.10 81.67,25.71 R31.1
N$9
  Top 0.813: R14.1 C1.1 C11.1 IR.3
N$10
  Bottom 0.406: R6.1 Q2.3 78.81,60.95 R8.1 R17.1
N$11
  Top 0.406: Q7.1 R20.2 72.07,47.93 74.3,47.93 R19.1
N$12
  Top 0.406: R0.1 13.34,68.41 13.81,69.04 15.88,69.04 16.03,68.25 SD.2
N$14
  Bottom 0.406: R13.1 Q3.1
N$16
  Bottom 0.406: Q1.3 R5.1 R7.2
N$17
  Top 0.406: R42.1 Q5.1
N$18
  Bottom 0.406: D1.3 70.57,73.4 68.01,76.82 ON/OFF.1
N$19  (via drill 0.7 pad 1.5)
  Top 0.406: v80.08,59.65 v73.39,59.65 Q4.3
  Bottom 0.406: Q2.1 v73.39,59.65 | R7.1 v80.08,59.65
N$20  (via drill 0.7 pad 1.5)
  Top 0.406: v82.44,65.36 v75,65.36
  Bottom 0.406: v82.44,65.36 Q1.1 R8.2 | D1.1 v75,65.36
N$21
  Top 0.406: R12.2 Q4.1
N$22
  Bottom 0.406: AUX.4 ESP.13
N$23
  Bottom 0.406: R9.1 R11.2 Q3.3
N$25
  Bottom 0.406: AUX.2 ESP.9
N$26
  Top 1.016: POWSEL.2 62.87,39.36 61.59,44.33 | C12.2 61.59,44.33 | 61.59,44.33 C27.1
  Bottom 1.676: POWSEL.2 DISP.2
N$27
  Top 0.406: R45.1 71.75,12.37 TR2.1
  Bottom 0.61: R32.2 TR2.1
N$28
  Top 0.61: A1.8 C16.2
N$29  (via drill 0.7 pad 1.5)
  Top 0.406: A1.12 84.2,31.74 83.01,32.93 78.81,32.93 v73.71,37.79 | Q7.3 v70.22,47.47
  Bottom 0.406: v70.22,47.47 73.71,45.71 v73.71,37.79
N$30
  Top 0.406: A1.9 R36.1
N$31
  Top 0.406: R36.2 MODE.2
N$32
  Top 0.813: FB2.2 C23.2
  Top 1.27: C23.2 L+.1 L+.2
  Bottom 1.27: L+.1 L+.2
N$33
  Top 0.406: R46.1 78.11,12.37 TR1.2
  Bottom 0.61: R33.1 TR1.2
N$34
  Top 1.016: FB3.2 C25.2 R-.2
  Top 1.27: R-.2 R-.1
  Bottom 1.27: R-.2 R-.1
N$35
  Top 1.016: R+.2 C26.2 FB4.2
  Top 1.27: R+.2 R+.1
  Bottom 1.27: R+.2 R+.1
N$36
  Top 0.61: A1.1 89.44,38.72
  Top 0.813: 89.44,38.72 FB2.1
N$38
  Top 0.61: A1.3 86.75,34.91
  Top 0.813: 86.75,34.91 87.38,33.96 90.01,33.96 FB1.1
N$39
  Top 0.61: A1.14 86.75,31.1
  Top 0.813: 86.75,31.1 87.38,32.06 90.01,32.06 FB3.1
N$41
  Top 0.61: A1.16 89.69,29.04
  Top 1.016: 91.12,21.26 FB4.1 89.69,29.04
N$42
  Top 0.61: Q5.3 55.32,20.15 R15.2
N$44
  Top 0.406: Q8.3 R16.1 R42.2
N$47
  Top 0.406: R39.2 R40.2 | R38.1 R39.2 | C20.2 41.91,47.93 ESP.32 48.9,53.64 53.98,55.87 77.47,55.87 R39.2
N$49
  Bottom 0.406: R17.2 Q6.1
N$50
  Top 0.813: FB1.2 C24.2
  Top 1.27: C24.2 L-.2 L-.1
  Bottom 1.27: L-.2 L-.1
N$51
  Top 0.813: R26.1 R25.2 ENCODER.4
N$52
  Top 0.813: R24.1 R23.2 ENCODER.2
N$53
  Top 0.813: R21.1 R22.2 ENCODER.1
N$54
  Top 0.406: R28.1 50.99,7.61 R27.1 Q8.1
ONOFFI  (via drill 0.7 pad 1.5)
  Top 0.406: v70.55,52.69 63.34,52.69 62.87,52.22 60.64,52.22 60.17,52.69 49.91,52.69 ESP.34
  Bottom 0.406: R11.1 v70.55,52.69
ONOFFO
  Top 0.406: R12.1 48.65,55.48 ESP.30 R41.2
ROUT
  Top 0.406: PCM5102A.ROUT 66.67,21.26 72.39,21.26 R46.2
RST
  Top 0.406: 69.85,46.03 88.65,46.03 93.03,49.2 93.03,55.23 84.84,65.08 84.84,75.55 RESET.1 | 69.85,46.03 53.09,46.03 ESP.40 | DISP.5 69.85,34.12 69.85,46.03
SCLK  (via drill 0.7 pad 1.5)
  Top 0.406: R2.1 SD.5 v19.41,70.16
  Bottom 0.406: v19.41,70.16 21.02,70.16 23.25,66.03 23.25,61.58 ESP.8
SHDN
  Bottom 0.406: Q6.3 PS.5
SPI_DC/I2C_SCL  (via drill 0.7)
  Top 0.406: DISP.6 27.15,29.2 v8.89,43.49
  Bottom 0.406: v8.89,43.49 ESP.6
SPI_SS/I2C_SDA  (via drill 0.7)
  Top 0.406: v43.66,27.29 65.41,27.29 DISP.7
  Bottom 0.406: ESP.14 v43.66,27.29
TFTG
  Top 0.305: 42.23,12.37 44.13,12.37
  Top 0.406: LEDSEL.2 42.23,12.37 | 44.13,12.37 R28.2
TFTLED
  Bottom 0.406: ESP.27 36.83,17.13 LEDSEL.3
VDD
  Top 0.406: 82.94,36.98 A1.6
  Top 0.61: 81.03,42.06 82.94,36.98
  Top 1.016: 81.03,42.06 C18.1 R37.2
WS
  Bottom 0.406: PCM5102A.LCK 45.4,13.64 45.4,20.62 ESP.33
XDCS
  Top 0.406: AUX.5 21.91,15.39 32.7,15.39 34.29,17.13 ESP.25

### Text on the board
tNames: RadioESP32S3 | 5V | 3V3 | D | AB | PWM | L | R | FULL | LuRu 2025 | Manufactured by | JLCPCB
bNames: RadioESP32S3 | LuRu 2025 | Manufactured by | JLCPCB